# Altium schematic sheet Measurements.SchDoc
size A; SheetNumber: 8; SheetTotal: 8
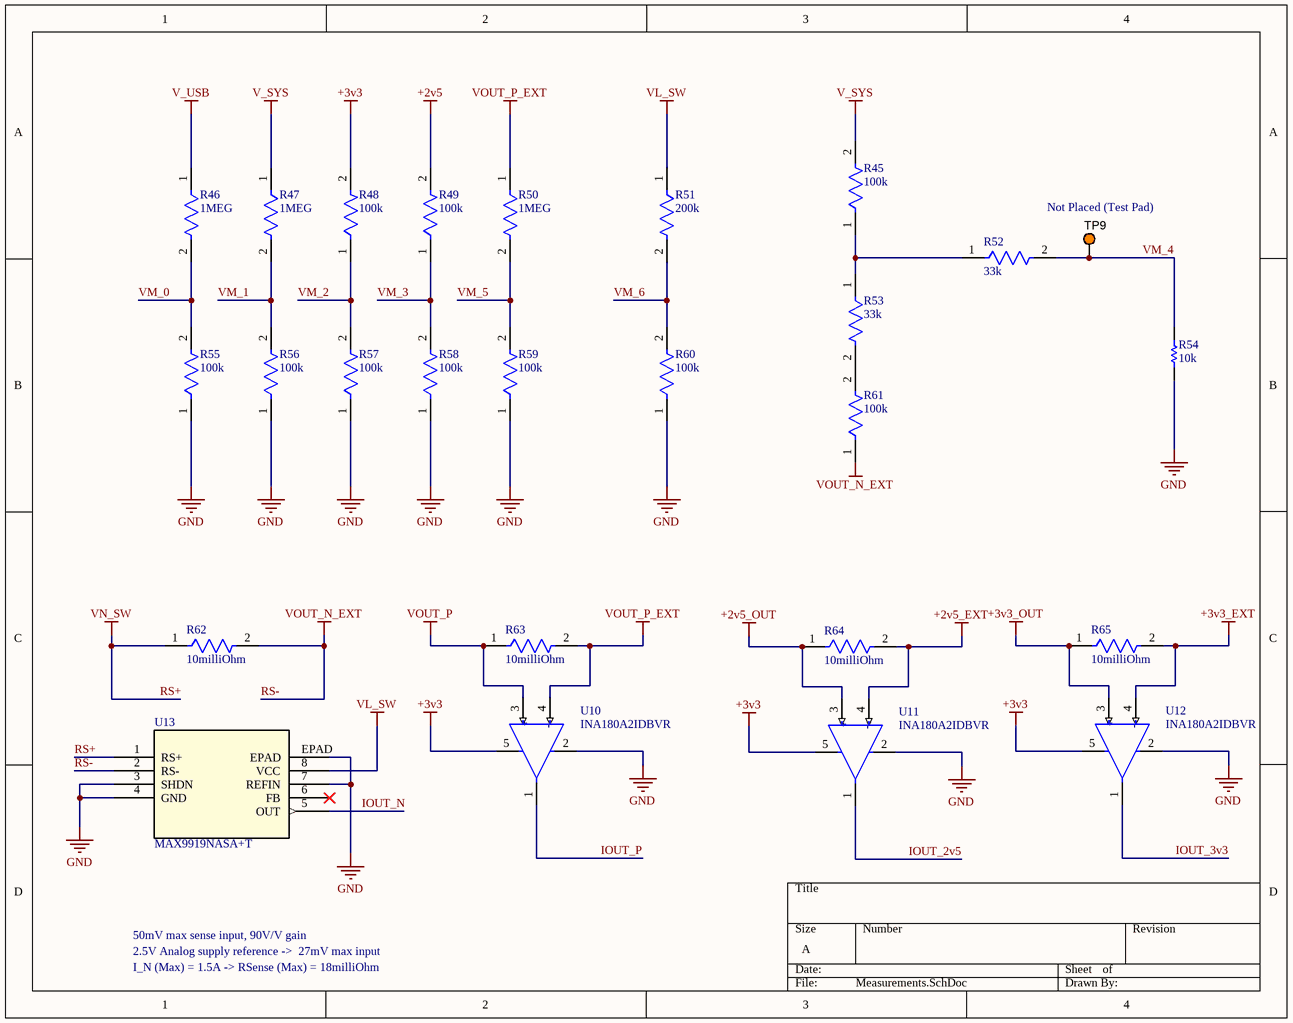
[diagram p0: Measurements.SchDoc]

## Parts
R45  100k  [FP-AC0603-IPC_A]
R46  1MEG  [FP-AC0603-IPC_A]
R47  1MEG  [FP-AC0603-IPC_A]
R48  100k  [FP-AC0603-IPC_A]
R49  100k  [FP-AC0603-IPC_A]
R50  1MEG  [FP-AC0603-IPC_A]
R51  200k  [FP-RMCF0603-IPC_A]
R52  33k  [FP-CRGCQ0603-IPC_C]
R53  33k  [FP-CRGCQ0603-IPC_C]
R54  10k  [RESC1608X55X30NL15T15]
R55  100k  [FP-AC0603-IPC_A]
R56  100k  [FP-AC0603-IPC_A]
R57  100k  [FP-AC0603-IPC_A]
R58  100k  [FP-AC0603-IPC_A]
R59  100k  [FP-AC0603-IPC_A]
R60  100k  [FP-AC0603-IPC_A]
R61  100k  [FP-AC0603-IPC_A]
R62  10milliOhm  [FP-CSRF0603-high-IPC_A]
R63  10milliOhm  [FP-CSRF0603-high-IPC_A]
R64  10milliOhm  [FP-CSRF0603-high-IPC_A]
R65  10milliOhm  [FP-CSRF0603-high-IPC_A]
TP9  5003  [KSTN-5003]  (value not drawn)  (no BOM)
U10  INA180A2IDBVR  [FP-DBV0005A-MFG]
U11  INA180A2IDBVR  [FP-DBV0005A-MFG]
U12  INA180A2IDBVR  [FP-DBV0005A-MFG]
U13  MAX9919NASA+T  [21-0111D_S8E-14_MXM]

## Nets
+2v5: R49.2
+2v5_EXT: R64.2 U11.4(IN-)
+2v5_OUT: R64.1 U11.3(IN+)
+3v3: R48.2 U10.5(VS) U11.5(VS) U12.5(VS)
+3v3_EXT: R65.2 U12.4(IN-)
+3v3_OUT: R65.1 U12.3(IN+)
GND: R54.1 R55.1 R56.1 R57.1 R58.1 R59.1 R60.1 U10.2(GND) U11.2(GND) U12.2(GND) U13.3(SHDN) U13.4(GND) U13.7(REFIN) U13.EPAD
RS+: R62.1 U13.1(RS+)  [also labelled VN_SW]
RS-: R61.1 R62.2 U13.2(RS-)  [also labelled VOUT_N_EXT]
V_SYS: R45.2 R47.1
V_USB: R46.1
VL_SW: R51.1 U13.8(VCC)
VOUT_P: R63.1 U10.3(IN+)
VOUT_P_EXT: R50.1 R63.2 U10.4(IN-)
IOUT_2v5: U11.1(OUT)
IOUT_3v3: U12.1(OUT)
IOUT_N: U13.5(OUT)
IOUT_P: U10.1(OUT)
VM_0: R46.2 R55.2
VM_1: R47.2 R56.2
VM_2: R48.1 R57.2
VM_3: R49.1 R58.2
VM_4: R52.2 R54.2 TP9.1
VM_5: R50.2 R59.2
VM_6: R51.2 R60.2
NetR45_1: R45.1 R52.1 R53.1
NetR53_2: R53.2 R61.2

Not connected (* = marked no-connect by the designer): U13 6(FB)*

## Notes on the sheet
- Not Placed (Test Pad)
- 50mV max sense input, 90V/V gain
- 2.5V Analog supply reference ->  27mV max input
- I_N (Max) = 1.5A -> RSense (Max) = 18milliOhm
- (in symbol CMP-04895-000287-1) +; -

## Library data of the parts
R45 R48 R49 R55-R61 = CMP-03412-043770-1: RES 100kΩ 1.00% 0.2W 0603
R46 R47 R50 = CMP-03412-042588-1: RES 1MΩ 1.00% 0.1W 0603; Tolerance: 1%; Resistance: 1MR; RoHS Compliant: Yes; Case/Package: 0603
R51 = CMP-26527-006122-1: 200kΩ ±1% 0.1W 0603 Thick Film Chip Resistor AEC-Q200 compliant; Resistance: 200kR; Max Power Dissipation: 100mW; Temperature Coefficient: 100ppm/°C; Series: RMCF; Case/Package: 0603; Width: 0.031inch; Features: Automotive AEC-Q200; Contact Plating: Tin; RoHS Compliant: Yes; Resistor Type: Thick Film; Min Operating Temperature: -55°C; Mount: Surface Mount; Height: 0.022inch; Packaging: Tape and Reel; Tolerance: 1%; Number of Terminations: 2; Radiation Hardening: No; Length: 0.061inch; Max Operating Temperature: 155°C
R52 R53 = CMP-03211-001378-1: CRGCQ0603 33KΩ 5% ±100ppm/°C 75V; Manufacturer Part Number: CRGCQ0603J33K; Manufacturer: TE Connectivity; Tolerance: 0.05; Power Rating: 0.1W; Temperature Range Low: -55°C; ComponentLink2URL: https://www.te.com/commerce/DocumentDelivery/DDEController?Action=showdoc&DocId=Data+Sheet%7F1773204-3%7F1%7Fpdf%7FEnglish%7FENG_DS_1773204-3_1.pdf%7F4-2176339-1037; Device Class L3: Chip SMD Resistors; Device Class L1: Passive Components; Temperature Coefficient: ±100ppm/°C; Temperature Range High: +155°C; Series: CRGCQ; Category: Res; Ambient Temperature Range High: +70°C; Temperature: -55°C to +155°C; RoHS: TRUE; Resistance: 33KΩ; Ipc Land Pattern Name: RESC16080X45; Octopart: https://octopart.com/crgcq0603j33k-te+connectivity-91018119; Lead Free: Yes; Height: 0.55mm; Device Class L2: Resistors; Composition: Thick Film; ComponentLink2Description: Datasheet; Value: 33KΩ; Voltage Rating: 75V; Package: CRGCQ0603
R54 = CMP-2000-00258-1: Part Number: ERJ-3EKF1502V; Manufacturer: Panasonic
R62-R65 = CMP-26527-001905-1: RES 0.01 OHM 1% 1/4W 0603; Resistance: 10mR; Max Power Dissipation: 250mW; Temperature Coefficient: 75ppm/°C; Tolerance: 1%; Lead Free: Lead Free; Series: CSRF; Max Operating Temperature: 170°C; Number of Terminations: 2; Packaging: Tape and Reel; RoHS Compliant: Yes; Military Standard: Not; Resistor Type: Metal Foil; Length: 0.063inch; Width: 0.031inch; Case Code (Imperial): 0603; Case/Package: 0603; Depth: 0.8mm; Case Code (Metric): 1608; Features: Moisture Resistant; Min Operating Temperature: -55°C; Mount: Surface Mount; Construction: Rectangular; Height: 0.03inch
TP9 = CMP-1672-00009-1: Test Point, Orange, 1-Pin THD, RoHS; Peak Reverse Current: 600 uA; Forward Current: 3 A; Max Surge Current: 80 A; Forward Voltage: 1.08 V; Max Operating Temperature: 150 degC; PackageReference: 5003; Pins: 2; ComponentLink2URL: http://keyelco.com/userAssets/file/M65p56.pdf; PackageDescription: 1-Pin Through Hole Device, Dia 2.54 mm; Weight: 0.01 lb; Diameter: 5.3 mm; Mount: Through Hole; Package Quantity: 500; Packaging: Bulk; Min Operating Temperature: -65 degC; ComponentLink1Description: Manufacturer URL; Height: 0.25 inch; ComponentLink1URL: http://www.keyelco.com/; ComponentLink2Description: Datasheet; Width: 0.25 inch; REACH SVHC: No SVHC; RoHSCompliant: true; Radiation Hardening: No; Length: 9.5 mm; DatasheetVersion: Jun-15
U10-U12 = CMP-04895-000287-1: IC CURR SENSE 1 CIRCUIT SOT23-5; Operating Supply Current: 260uA; -3db Bandwidth: 350kHz; Slew Rate: 2V/µs; Number of Circuits: 1; Input Offset Voltage (Vos): 100uV; Input Bias Current: 100nA; Mount: Surface Mount; Max Operating Temperature: 125°C; Packaging: Tape and Reel; Min Operating Temperature: -40°C; Case/Package: SOT-23-5; RoHS Compliant: Yes
U13 = MAX9919NASA+T: -20V to +75V Input Range, Precision Uni-/Bidirectional, Current-Sense Amplifiers; Manufacturer_Name: Analog Devices / Maxim Integrated; Copyright: Copyright (C) 2026 Ultra Librarian. All rights reserved.; Manufacturer_Part_Number: MAX9919NASA+T; RefDes: RefDes; Type: Type